# EAGLE design buratino (EAGLE 7.1.0)
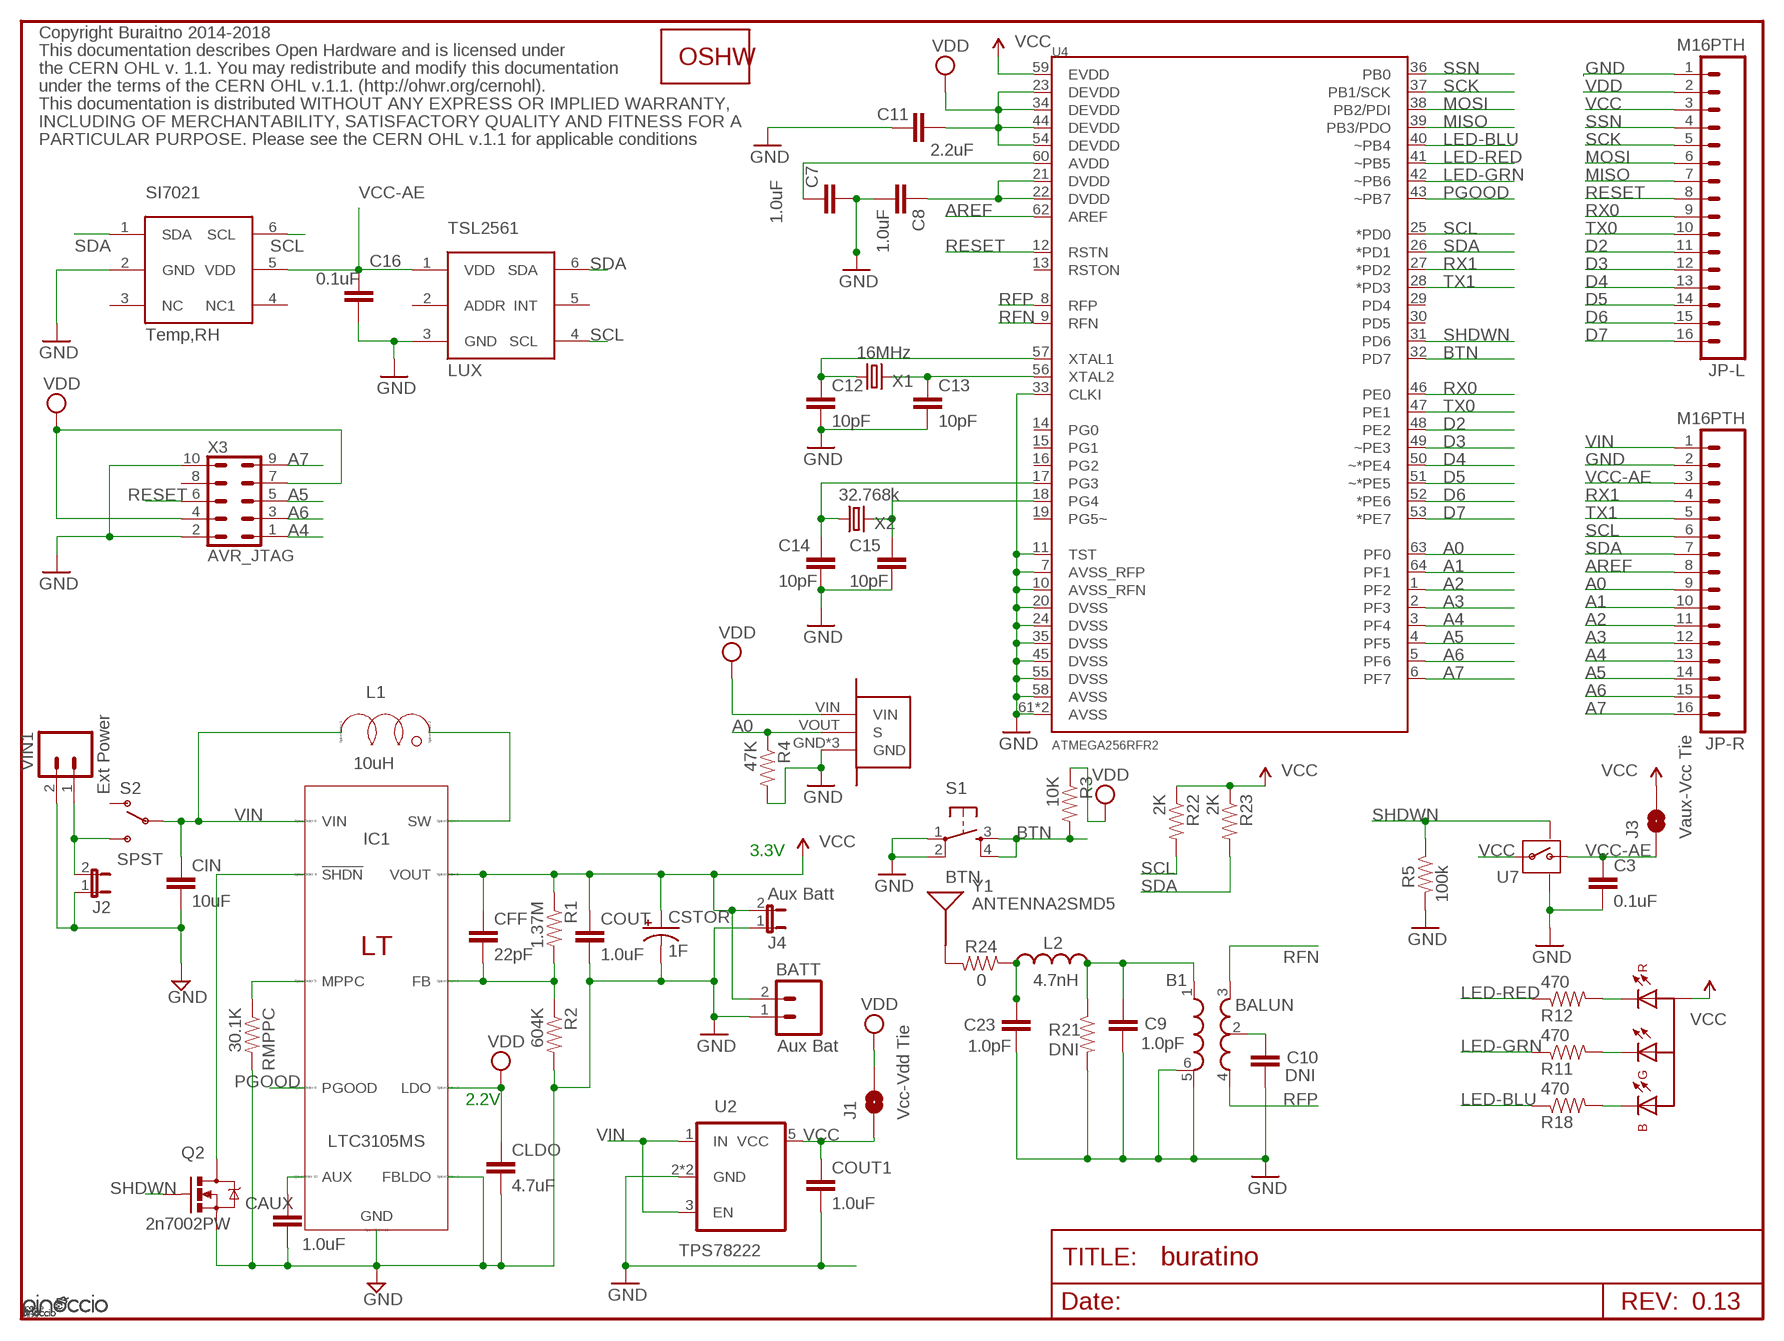
[diagram p0: schematic, sheet 1]

## Parts
B1  BALUN  BALUN0805  [BALUN]
BATT  Aux Bat  M02JST-SFH  [JST-SFH]
C3  0.1uF  CAP0603-CAP  [0603-CAP]
C7  1.0uF  CAP0603-CAP  [0603-CAP]
C8  1.0uF  CAP0603-CAP  [0603-CAP]
C9  1.0pF  CAP0402-CAP  [0402-CAP]
C10  DNI  CAP0402-CAP  [0402-CAP]
C11  2.2uF  CAP0603-CAP  [0603-CAP]
C12  10pF  CAP0402-CAP  [0402-CAP]
C13  10pF  CAP0402-CAP  [0402-CAP]
C14  10pF  CAP0402-CAP  [0402-CAP]
C15  10pF  CAP0402-CAP  [0402-CAP]
C16  0.1uF  CAP0603-CAP  [0603-CAP]
C23  1.0pF  CAP0402-CAP  [0402-CAP]
CAUX  1.0uF  CAP0603-CAP  [0603-CAP]
CFF  22pF  CAP0603-CAP  [0603-CAP]
CIN  10uF  CAP0805  [0805]
CLDO  4.7uF  CAP0603-CAP  [0603-CAP]
COUT  1.0uF  CAP0603-CAP  [0603-CAP]
COUT1  1.0uF  CAP0603-CAP  [0603-CAP]
CSTOR  1F  EEC-RG0V105H  [SCAP1]
IC1  LTC3105MS  [MSOP12]
J1  Vcc-Vdd Tie  SOLDERJUMPERNO  [SJ_2S-NO]
J2  Ext Battery  JUMPER-2PTH  [1X02]
J3  Vaux-Vcc Tie  SOLDERJUMPERNO  [SJ_2S-NO]
J4  Aux Batt  JUMPER-2PTH  [1X02]
JP-L  M16PTH  [1X16]
JP-R  M16PTH  [1X16]
L1  10uH  NR6045T100M  [NR2]
L2  4.7nH  INDUCTOR  [0402-CAP]
PIR  IRS-B210ST01R1  [PIRSMT]
Q2  2n7002PW  MOSFET-NCHANNEL2N7002PW  [SOT323]
R1  1.37M  RESISTOR0603-RES  [0603-RES]
R2  604K  RESISTOR0603-RES  [0603-RES]
R3  10K  RESISTOR0603-RES  [0603-RES]
R4  47K  RESISTOR0603-RES  [0603-RES]
R5  100k  RESISTOR0603-RES  [0603-RES]
R11  470  RESISTOR0603-RES  [0603-RES]
R12  470  RESISTOR0603-RES  [0603-RES]
R18  470  RESISTOR0603-RES  [0603-RES]
R21  DNI  RESISTOR0402-RES  [0402-RES]
R22  2K  RESISTOR0603-RES  [0603-RES]
R23  2K  RESISTOR0603-RES  [0603-RES]
R24  0  RESISTOR0402-RES  [0402-RES]
RMPPC  30.1K  RESISTOR0603-RES  [0603-RES]
S1  BTN  TAC_SWITCHPTH  [TACTILE-PTH]
S2  SPST  SWITCH-SPSTSMD2  [SWITCH-SPDT-SMD]
SI7021  Temp,RH  SI7021A10  [DFN6-3X3]
TSL2561  LUX  TSL2561DFN  [DFN6-2X2]
U2  TPS78222  LDO-TPS78233  [SOT23-5]
U4  ATMEGA256RFR2  ATMEGA128RFA1  [QFN-64]
U7  SWITCH  SWITCH-MOSFETTDFN4  [TDFN4]
U8  LED-RGB  LED-RGBPLCC4  [PLCC4]
U$2  LOGO-OSHWSILKSCREEN  [LOGO-OSHW-SS]
VIN1  Ext Power  M02JST-SFH  [JST-SFH]
X1  16MHz  CRYSTALABM10  [CRYSTAL-SMD-2.5X2-ABM10]
X2  32.768k  CRYSTAL-NOGND  [CRYSTAL-SMD-2X1.2-ABS06]
X3  AVR_JTAG  PHB_1MM27_2X05_SNS  [PHB_1MM27_2X05_SNS]
Y1  ANTENNA2SMD5  [ANTENNA-CHIP5]

## Nets
A0: JP-R.9 PIR.VOUT(S) R4.1 U4.63(PF0)
A1: JP-R.10 U4.64(PF1)
A2: JP-R.11 U4.1(PF2)
A3: JP-R.12 U4.2(PF3)
A4: JP-R.13 U4.3(PF4) X3.1
A5: JP-R.14 U4.4(PF5) X3.5
A6: JP-R.15 U4.5(PF6) X3.3
A7: JP-R.16 U4.6(PF7) X3.9
AREF: JP-R.8 U4.62(AREF)
BTN: R3.2 S1.3 S1.4 U4.32(PD7)
D2: JP-L.11 U4.48(PE2)
D3: JP-L.12 U4.49(~PE3)
D4: JP-L.13 U4.50(~*PE4)
D5: JP-L.14 U4.51(~*PE5)
D6: JP-L.15 U4.52(*PE6)
D7: JP-L.16 U4.53(*PE7)
GND [GND]: B1.5(GND) B1.6(GND) BATT.1 C3.2 C7.2 C8.2 C9.2 C10.2 C11.2 C12.2 C13.2 C14.2 C15.2 C16.2 C23.2 CAUX.2 CIN.2 CLDO.2 COUT1.2 COUT.2 CSTOR.2(-) IC1.3(FBLDO) IC1.6(GND) IC1.7(GND) J2.1 J4.1 JP-L.1 JP-R.2 PIR.GND PIR.GND*1(GND) PIR.GND*2(GND) Q2.2(S) R2.2 R4.2 R5.2 R21.2 RMPPC.2 S1.1 S1.2 SI7021.2(GND) TSL2561.3(GND) U2.2(GND) U2.4(GND) U4.7(AVSS_RFP) U4.10(AVSS_RFN) U4.11(TST) U4.20(DVSS) U4.24(DVSS) U4.33(CLKI) U4.35(DVSS) U4.45(DVSS) U4.55(DVSS) U4.58(AVSS) U4.61(AVSS) U4.PADDLE(AVSS) U7.P$2(GND) U7.P$5(GND) VIN1.2 X3.2 X3.10
LED-BLU: R18.1 U4.40(~PB4)
LED-GRN: R11.1 U4.42(~PB6)
LED-RED: R12.1 U4.41(~PB5)
MISO: JP-L.7 U4.39(PB3/PDO)
MOSI: JP-L.6 U4.38(PB2/PDI)
N$1: R12.2 U8.P$1(R-C)
N$2: C23.1 L2.2 R24.1
N$4 [RF Antenna]: B1.1(IN) C9.1 L2.1 R21.1
N$5: R11.2 U8.P$4(G-C)
N$6: R18.2 U8.P$3(B-C)
N$10: C7.1 U4.60(AVDD)
N$12: IC1.9(SW) L1.P$2(B)
N$13: B1.2(RFGND) C10.1
N$14: CAUX.1 IC1.12(AUX)
N$15: C12.1 U4.57(XTAL1) X1.P$1
N$16: C13.1 U4.56(XTAL2) X1.P$3
N$17: C14.1 U4.17(PG3) X2.P$1
N$18: C15.1 U4.18(PG4) X2.P$2
N$19: CFF.2 IC1.1(FB) R1.2 R2.1
N$20: C8.1 U4.21(DVDD) U4.22(DVDD)
N$21: IC1.4(!SHDN) Q2.3(D)
N$23: IC1.5(MPPC) RMPPC.1
N$24: J2.2 S2.3(S) VIN1.1
N$28: R24.2 Y1.FEED(SIGNAL)
PGOOD: IC1.10(PGOOD) U4.43(~PB7)
RESET: JP-L.8 U4.12(RSTN) X3.6
RFN: B1.3(OUT1) U4.9(RFN)
RFP: B1.4(OUT2) U4.8(RFP)
RX0: JP-L.9 U4.46(PE0)
RX1: JP-R.4 U4.27(*PD2)
SCK: JP-L.5 U4.37(PB1/SCK)
SCL: JP-R.6 R22.2 SI7021.6(SCL) TSL2561.4(SCL) U4.25(*PD0)
SDA: JP-R.7 R23.2 SI7021.1(SDA) TSL2561.6(SDA) U4.26(*PD1)
SHDWN: Q2.1(G) R5.1 U4.31(PD6) U7.P$4(ON)
SSN: JP-L.4 U4.36(PB0)
TX0: JP-L.10 U4.47(PE1)
TX1: JP-R.5 U4.28(*PD3)
VCC [VCC]: BATT.2 CFF.1 COUT1.1 COUT.1 CSTOR.1(+) IC1.11(VOUT) J1.1 J3.2 J4.2 JP-L.3 R1.1 R22.1 R23.1 U2.5(VCC) U4.59(EVDD) U7.P$3(IN) U8.P$2(A)
VCC-AE: C3.1 C16.1 J3.1 JP-R.3 SI7021.5(VDD) TSL2561.1(VDD) U7.P$1(OUT)
VDD: C11.1 CLDO.1 IC1.2(LDO) J1.2 JP-L.2 PIR.VIN R3.1 U4.23(DEVDD) U4.34(DEVDD) U4.44(DEVDD) U4.54(DEVDD) X3.4 X3.7
VIN: CIN.1 IC1.8(VIN) JP-R.1 L1.P$1(A) S2.2(P) U2.1(IN) U2.3(EN)
Unconnected: S2.1(O) SI7021.3(NC) SI7021.4(NC1) TSL2561.2(ADDR) TSL2561.5(INT) U4.13(RSTON) U4.14(PG0) U4.15(PG1) U4.16(PG2) U4.19(PG5~) U4.29(PD4) U4.30(PD5) X3.8

## Notes on the sheet
- Copyright Buraitno 2014-2018
- This documentation describes Open Hardware and is licensed under
- the CERN OHL v. 1.1. You may redistribute and modify this documentation
- under the terms of the CERN OHL v.1.1. (http://ohwr.org/cernohl).
- This documentation is distributed WITHOUT ANY EXPRESS OR IMPLIED WARRANTY,
- INCLUDING OF MERCHANTABILITY, SATISFACTORY QUALITY AND FITNESS FOR A
- PARTICULAR PURPOSE. Please see the CERN OHL v.1.1 for applicable conditions
- 3.3V
- 2.2V
- 0.13
- /Volumes/Data/Users/eric/Desktop/pinoccio.bmp
- /Volumes/Data/Users/eric/Desktop/pinoccio-1in.bmp | /Volumes/Data/Users/eric/Desktop/pinoccio-full-3-4in.bmp | /Volumes/Data/Users/eric/Desktop/pinoccio-full-3-4in.bmp

## Power pins joined to a net without a drawn wire
GND: X1.P$2(GND) X1.P$4(GND)

## Library data of the parts
B1 = Pinoccio:BALUN
BATT VIN1 = bean:M02: Header 2 Standard 2-pin 0.1" header. Use with straight break away headers (SKU : PRT-00116), right angle break away headers (PRT-00553), swiss pins (PRT-00743), machine pins (PRT-00117), and female headers (PRT-00115). Molex polarized connector foot print use with SKU : PRT-08233 with associated crimp pins and housings.
C3 C7-C16 C23 CAUX CFF CIN CLDO COUT COUT1 = Pinoccio:CAP: Capacitor Standard 0603 ceramic capacitor, and 0.1" leaded capacitor.
CSTOR = 620-Misc:EEC-RG
IC1 = @Power:LTC3105: LT-Spice library generated with : ltspice.ulp from: D:/Program Files (x86)/LTC/LTspiceIV/lib/sym/PowerProducts/LTC3108*.asy at 07.10.2012 17:14:56
J1 J3 = Pinoccio:SOLDERJUMPER: Solder Jumper Standard SMD solder jumper. Used to automate production. Two varients : Normally Open and Normally Closed are the same, but have different paste layers. NC will have a large amount of paste and should jumper during reflow.
J2 J4 = Pinoccio:JUMPER-2: Jumper Basic 0.1" spaced jumper. Use with breakaway headers.
JP-L JP-R = 620-Misc:M16
L1 = @Misc:NR6045
L2 = Pinoccio:INDUCTOR
PIR = 620-Sensors:IRS-B210ST01
Q2 = SparkFun-DiscreteSemi:MOSFET-NCHANNEL: Common NMOSFET Parts MFG P/N Store ID Prod ID FDD8780 TRANS-09984 SI7820DN TRANS-11055 FDS6630A IC-08089 2N7002PW TRANS-11151 FQP30N06L COM-10213 TRANS-10060 BSS123LT1G TRANS-08345 BSS138 TRANS-00830 BS170 2N7000; PROD_ID: TRANS-11151
R1-R5 R11 R12 R18 R21-R24 RMPPC = Pinoccio:RESISTOR: Resistor Basic schematic elements and footprints for 0603, 1206, and PTH resistors.
S1 = SparkFun-Electromechanical:TAC_SWITCH: Momentary Switch Button commonly used for reset or general input. Spark Fun Electronics SKU : COM-00097 SMT- SWCH-08247
S2 = Pinoccio:SWITCH-SPST: SPST Switch Simple slide switch. Spark Fun Electronics SKU : COM-00102
SI7021 = @Sensors:SI7021
TSL2561 = @Sensors:TSL2561
U2 = Pinoccio:LDO-TPS78233: Voltage Regulator LDO 500nA Ground Current, 150mA, Ultra-Low Quiescent Current Low-Dropout Linear Regulator.
U4 = Pinoccio:ATMEGA128RFA1
U7 = Pinoccio:SWITCH-MOSFET
U8 = Pinoccio:LED-RGB: LED-Bicolor Red/Green
U$2 = Pinoccio:LOGO-OSHW
X1 = Pinoccio:CRYSTAL: Crystals Various standard crystals. Proven footprints. Spark Fun Electronics SKU : COM-00534
X2 = Pinoccio:CRYSTAL-NOGND
X3 = 620-Misc:PHB_1MM27_2X05_*: Pin Header Box-Type, 1.27mm/0.5"/50mil Pitch, 2x05 Circuits Note: see library description for an important note about THT-version
Y1 = SparkFun:ANTENNA2: Antenna Single endded antenna. Common with smaller chip antennas. CHIP4 package is the GPS Chip Antenna SKU: GPS-08418. CHIP5 package is 2.4GHz chip antenna SKU: WRL-00144.

## Net classes
0 Default: width 0.203 mm
1 VCC: width 0.305 mm
2 LEDPower: width 0.203 mm
3 ButtonSignal: width 0.203 mm
4 RF Antenna: width 0.305 mm
5 GND: width 0.203 mm

## Board
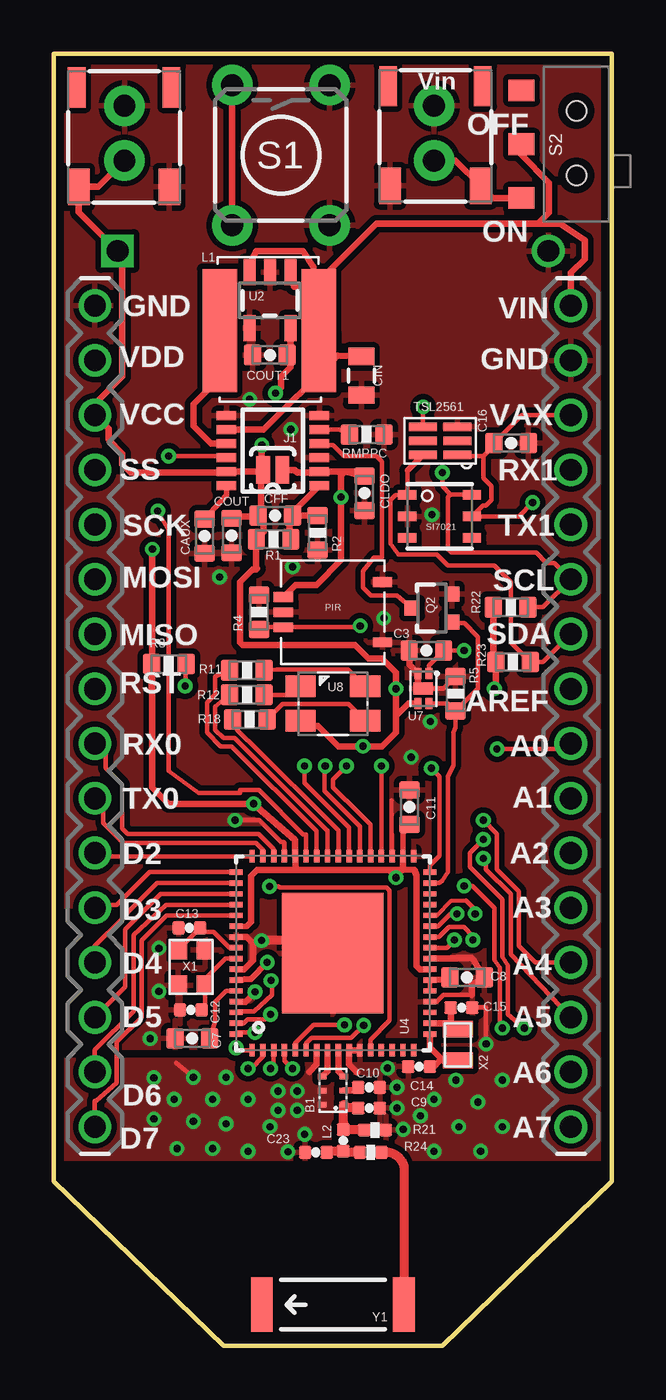
[diagram p1: board, top side]
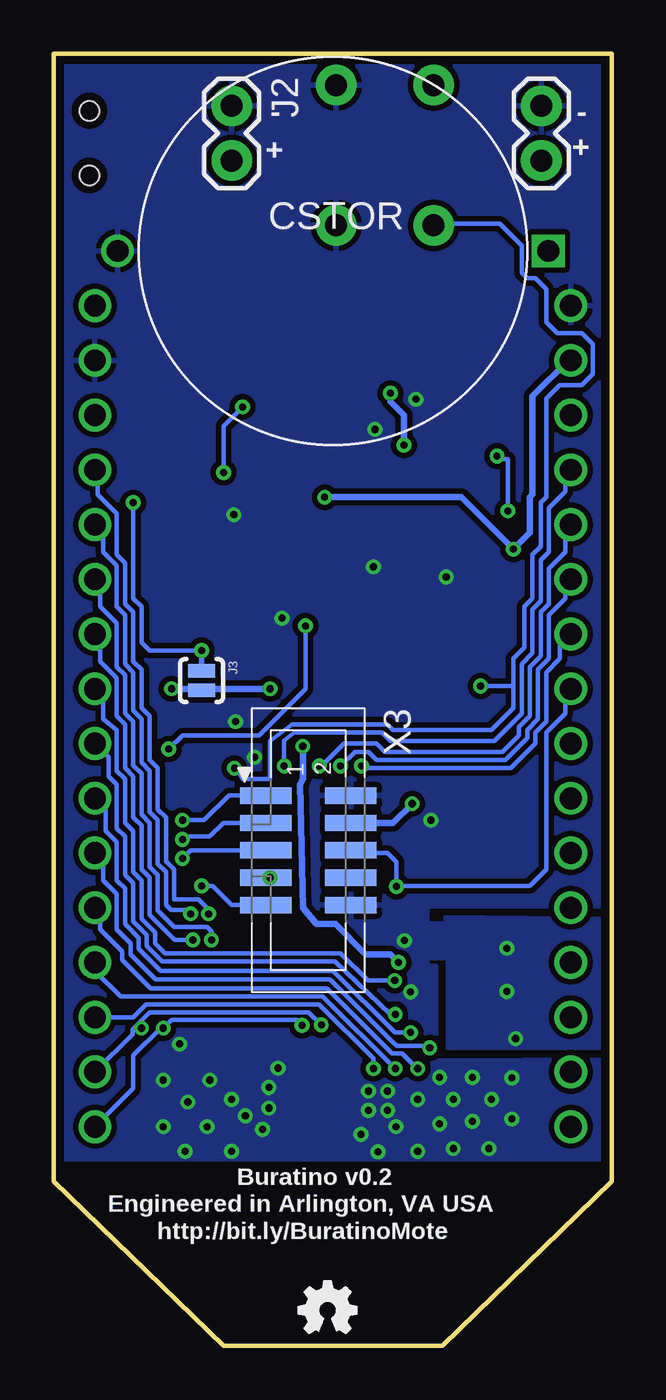
[diagram p2: board, bottom side, seen from below]

Size 25.91 x 59.94 mm. Coordinates in mm from the lower left corner, seen from the top.
Outline: 18.03,0 7.87,0 0,7.62 0,59.94 25.91,59.94 25.91,7.62 18.03,0
Copper layers (1*16): Top 0.0356mm / dielectric 1.5011mm / Bottom 0.0356mm
Design rules "OshPark": minimum track width 6mil, minimum drill 13mil, track to track 6mil, track to pad 6mil, pad to pad 6mil, via to via 6mil, smd to smd 6mil, copper to edge 15mil, drill to drill 6mil, minimum pad ring 7mil, minimum via ring 7mil, stop-mask expansion 3mil, vias tented up to drill 0mil, thermal gap 10mil
tKeepout: area 12.7,11.3 to 13.6,11.7; area 11.8,11.9 to 12.4,12.4; area 13.4,12.1 to 13.9,12.4; area 11.7,11.7 to 12.2,11.9; area 11.7,11.3 to 12.6,11.7

### Footprints (pad centres in the part's own frame; a part is rotated, then mirrored left to right if it is on the bottom)
BALUN = smd 0.27 x 0.4: 1 -0.7,-0.5; 2 -0.05,-0.5; 3 0.6,-0.5; 4 0.6,0.5; 5 -0.05,0.5; 6 -0.7,0.5
JST-SFH = smd 1.7 x 1: 1 5.36,4.7; 2 5.36,0.5 | smd 1.876 x 0.813: P$0 0.74,4.8; P$1 0.74,0.4
0603-CAP = smd 0.8 x 0.95: 1 -0.8,0; 2 0.8,0
0402-CAP = smd 0.6 x 0.6: 1 -0.5,0; 2 0.5,0
0805 = smd 0.8 x 1.2: 1 -0.9,0; 2 0.9,0
SCAP1 = drill 1.016 square: 1 10,0 | drill 1.016: 2 -10,0
MSOP12 = smd 0.9 x 0.42: 1 -2.163,1.625; 2 -2.163,0.975; 3 -2.163,0.325; 4 -2.163,-0.325; 5 -2.163,-0.975; 6 -2.163,-1.625; 7 2.15,-1.625; 8 2.15,-0.975; 9 2.15,-0.325; 10 2.15,0.325; 11 2.15,0.975; 12 2.15,1.625
SJ_2S-NO = smd 0.635 x 1.27: 1 -0.45,0; 2 0.45,0
1X02 = drill 1.016 pad 1.88: 1 0,0; 2 2.54,0
1X16 = drill 1.016 pad 1.27: 1 0,0 | drill 1.016: 2 2.54,0; 3 5.08,0; 4 7.62,0; 5 10.16,0; 6 12.7,0; 7 15.24,0; 8 17.78,0; 9 20.32,0; 10 22.86,0; 11 25.4,0; 12 27.94,0; 13 30.48,0; 14 33.02,0; 15 35.56,0; 16 38.1,0
NR2 = smd 1.6 x 5.7: P$1 2.3,0; P$2 -2.3,0
PIRSMT = smd 0.9 x 0.45: GND -2.3,0; GND*1 2.3,1.4; GND*2 2.3,-1.4; VIN -2.3,0.7; VOUT -2.3,-0.7
SOT323 = smd 0.7 x 0.7: 1 -0.65,-0.925; 2 0.65,-0.925; 3 0,0.925
0603-RES = smd 0.8 x 0.95: 1 -0.8,0; 2 0.8,0
0402-RES = smd 0.6 x 0.6: 1 -0.5,0; 2 0.5,0
TACTILE-PTH = drill 1.016 pad 1.88: 1 -3.251,2.261; 2 3.251,2.261; 3 -3.251,-2.261; 4 3.251,-2.261
SWITCH-SPDT-SMD = smd 1 x 1.2: 1 -2.5,-2.55; 2 0,-2.55; 3 2.5,-2.55 | hole 0.9: -1.55,0; 1.45,0
DFN6-3X3 = smd 0.85 x 0.45: 1 -1.5,1; 2 -1.5,0; 3 -1.5,-1; 4 1.5,-1; 5 1.5,0; 6 1.5,1
DFN6-2X2 = smd 1.3 x 0.4: 1 -0.8,0.65; 2 -0.8,0; 3 -0.8,-0.65; 4 0.8,-0.65; 5 0.8,0; 6 0.8,0.65
SOT23-5 = smd 0.55 x 1.2: 1 -0.95,-1.3; 2 0,-1.3; 3 0.95,-1.3; 4 0.95,1.3; 5 -0.95,1.3
QFN-64 = smd 0.6 x 0.25: 1 -4.5,3.75; 2 -4.5,3.25; 3 -4.5,2.75; 4 -4.5,2.25; 5 -4.5,1.75; 6 -4.5,1.25; 7 -4.5,0.75; 8 -4.5,0.25; 9 -4.5,-0.25; 10 -4.5,-0.75; 11 -4.5,-1.25; 12 -4.5,-1.75; 13 -4.5,-2.25; 14 -4.5,-2.75; 15 -4.5,-3.25; 16 -4.5,-3.75; 33 4.5,-3.75; 34 4.5,-3.25; 35 4.5,-2.75; 36 4.5,-2.25; 37 4.5,-1.75; 38 4.5,-1.25; 39 4.5,-0.75; 40 4.5,-0.25; 41 4.5,0.25; 42 4.5,0.75; 43 4.5,1.25; 44 4.5,1.75; 45 4.5,2.25; 46 4.5,2.75; 47 4.5,3.25; 48 4.5,3.75 | smd 0.25 x 0.6: 17 -3.75,-4.5; 18 -3.25,-4.5; 19 -2.75,-4.5; 20 -2.25,-4.5; 21 -1.75,-4.5; 22 -1.25,-4.5; 23 -0.75,-4.5; 24 -0.25,-4.5; 25 0.25,-4.5; 26 0.75,-4.5; 27 1.25,-4.5; 28 1.75,-4.5; 29 2.25,-4.5; 30 2.75,-4.5; 31 3.25,-4.5; 32 3.75,-4.5; 49 3.75,4.5; 50 3.25,4.5; 51 2.75,4.5; 52 2.25,4.5; 53 1.75,4.5; 54 1.25,4.5; 55 0.75,4.5; 56 0.25,4.5; 57 -0.25,4.5; 58 -0.75,4.5; 59 -1.25,4.5; 60 -1.75,4.5; 61 -2.25,4.5; 62 -2.75,4.5; 63 -3.25,4.5; 64 -3.75,4.5 | smd 5.588 x 4.699: PADDLE 0,0
TDFN4 = smd 0.325 x 0.5: P$1 0.35,0.1; P$2 0.85,0.1; P$3 0.85,1.5; P$4 0.35,1.5 | smd 0.9 x 0.55: P$5 0.6,0.8
PLCC4 = smd 1.4 x 1: P$1 -1.5,0.75; P$2 -1.5,-0.85; P$3 1.5,-0.85; P$4 1.5,0.75
CRYSTAL-SMD-2.5X2-ABM10 = smd 0.9 x 0.8: P$1 -0.85,-0.65; P$2 0.8,-0.65; P$3 0.8,0.6; P$4 -0.85,0.6
CRYSTAL-SMD-2X1.2-ABS06 = smd 0.75 x 1.4: P$1 -0.725,0; P$2 0.725,0
PHB_1MM27_2X05_SNS = smd 0.76 x 2.4: 1 -2.54,-1.977; 2 -2.54,1.977; 3 -1.27,-1.977; 4 -1.27,1.977; 5 0,-1.977; 6 0,1.977; 7 1.27,-1.977; 8 1.27,1.977; 9 2.54,-1.977; 10 2.54,1.977
ANTENNA-CHIP5 = smd 1.016 x 2.54: FEED -3.302,0; NC 3.302,0

### Placement (x,y rotation side)
B1  12.95,11.89 90 top
BATT  0.66,59.13 270 top
C3  17.3,32.26 180 top
C7  6.43,14.26 180 top
C8  19.18,17.09 0 top
C9  14.63,11.02 0 top
C10  14.63,11.99 0 top
C11  16.51,24.99 90 top
C12  6.36,15.58 180 top
C13  6.29,19.39 180 top
C14  16.95,12.95 180 top
C15  18.92,15.69 0 top
C16  21.23,41.88 0 top
C23  12.17,8.97 180 top
CAUX  7,37.57 270 top
CFF  10.27,38.52 0 top
CIN  14.27,45.01 270 top
CLDO  14.41,39.56 270 top
COUT  8.25,37.59 270 top
COUT1  10.03,45.97 180 top
CSTOR  12.95,50.8 0 bottom
IC1  10.16,41.53 180 top
J1  10.16,40.64 0 top
J2  17.65,57.53 270 bottom
J3  19.05,30.86 270 bottom
J4  3.28,57.53 270 bottom
JP-L  1.91,48.26 270 top
JP-R  24,48.26 270 top
L1  9.99,47.1 0 top
L2  13.44,9.53 270 top
PIR  12.95,34.04 0 top
Q2  17.55,34.23 90 top
R1  10.2,37.41 0 top
R2  12.24,37.72 270 top
R3  5.33,31.62 0 top
R4  9.53,34.04 90 top
R5  18.64,30.25 90 top
R11  8.97,31.34 0 top
R12  8.97,30.2 0 top
R18  9.09,29.06 0 top
R21  14.91,10.01 0 top
R22  21.21,34.26 0 top
R23  21.31,31.72 0 top
R24  14.71,8.97 0 top
RMPPC  14.52,42.28 0 top
S1  10.54,55.24 270 top
S2  24.26,55.75 270 top
SI7021  17.91,38.48 0 top
TSL2561  17.94,41.99 180 top
U2  10.03,48.51 180 top
U4  12.95,18.21 90 top
U7  17.75,31.29 180 top
U8  12.95,29.84 0 top
U$2  14.61,0.51 0 bottom
VIN1  15.11,59.18 270 top
X1  6.38,17.57 90 top
X2  18.76,13.96 90 top
X3  14.1,22.99 270 bottom
Y1  12.95,1.91 180 top

### Tracks (layer width: path | path; a pad name or v marks a point on that pad's centre or on a via)
A0  (via drill 0.33)
  Top 0.203: v10.06,15.37 9.83,15.14 8.99,15.14 8.81,14.96 U4.63 | U4.63 8.43,14.96 | U4.63 | R4.1 9.62,33.34 PIR.VOUT 14.16,33.34 v14.22,33.4 | v20.57,27.69 23.75,27.69 JP-R.9
  Bottom 0.203: v10.06,15.37 10.29,15.37 12.85,17.83 20.88,17.83 21.59,18.54 21.59,19.05 22.23,19.68 22.23,21.46 22.61,21.84 22.61,23.62 22.99,24 22.99,26.04 23.37,26.42 23.37,27.3 JP-R.9 | v14.22,33.4 14.22,30.48 16.38,28.32 19.94,28.32 v20.57,27.69
A1  (via drill 0.33)
  Top 0.203: U4.64 8.52,14.53 v9.35,14.53
  Bottom 0.203: v9.35,14.53 10.08,14.53 12.95,17.4 20.96,17.4 21.97,18.41 21.97,18.92 22.61,19.56 22.61,21.21 22.99,21.59 22.99,23.37 23.5,23.88 23.5,24.89 JP-R.10
A2  (via drill 0.33)
  Top 0.203: v8.46,13.82 8.56,13.71 U4.1
  Bottom 0.203: v8.46,13.82 8.56,13.92 9.98,13.92 10.21,14.12 13.08,16.99 21.18,16.99 22.35,18.16 22.35,18.67 22.99,19.3 22.99,20.95 23.62,21.59 23.62,22.48 JP-R.11
A3  (via drill 0.33)
  Top 0.203: U4.2 9.7,13.41 9.14,12.85 v9.02,12.85
  Bottom 0.203: v9.02,12.85 9.02,12.83 9.75,13.56 10.21,13.56 13.23,16.59 21.41,16.59 22.73,17.91 22.73,18.29 23.75,19.3 23.75,20.07 JP-R.12
A4  (via drill 0.33)
  Top 0.203: U4.3 10.2,13 v10.06,12.85 | JP-R.13 22.35,17.78 21.59,18.54 21.59,21.08 20.57,22.1 20.57,23.75 v19.94,24.38
  Bottom 0.203: v10.06,12.85 13.44,16.2 22.81,16.2 24,17.4 JP-R.13 | X3.1 17.78,25.53 18.92,24.38 v19.94,24.38
A5  (via drill 0.33)
  Top 0.203: U4.4 10.7,13.22 v11.07,12.85 | JP-R.14 21.21,18.16 21.21,20.95 20.07,22.1 20.07,22.48 v19.94,22.61
  Bottom 0.203: v11.07,12.85 11.07,13.34 13.6,15.84 21.63,15.84 22.23,15.24 JP-R.14 | X3.5 19.56,22.99 v19.94,22.61
A6  (via drill 0.33)
  Top 0.203: U4.5 11.2,14.02 12.06,14.88 v13.49,14.88 | v19.94,23.5 19.3,22.86 19.3,22.23 20.83,20.7 20.83,18.03 21.08,17.65 21.08,15.37 v21.84,14.73
  Bottom 0.203: v13.49,14.88 14.07,15.47 21.46,15.47 21.84,15.09 | 21.84,15.09 22.25,14.68 22.25,14.45 JP-R.15 | v21.84,14.73 21.84,15.09 | X3.3 18.03,24.26 18.67,23.62 19.81,23.62 v19.94,23.5
A7  (via drill 0.33)
  Top 0.203: U4.6 11.7,14.02 11.96,14.28 13.78,14.28 v14.39,14.86 | v19.05,21.34 19.43,21.34 20.45,20.32 20.45,17.91 20.7,17.53 20.7,14.86 v20.83,14.73
  Bottom 0.203: v14.39,14.86 14.4,14.88 14.63,15.11 20.45,15.11 v20.83,14.73 20.96,14.73 22.23,13.46 22.23,11.94 JP-R.16 | X3.9 17.65,20.45 18.54,21.34 v19.05,21.34
AREF  (via drill 0.33)
  Top 0.203: v10.08,16.94 10.13,16.92 10.13,16.28 9.29,15.51 8.5,15.51 U4.62
  Bottom 0.203: v10.08,16.94 11.33,16.94 12.6,18.21 20.75,18.21 21.21,18.67 21.21,19.18 21.84,19.81 21.84,21.59 22.23,21.97 22.23,23.88 22.61,24.26 22.61,26.29 22.99,26.67 22.99,28.57 23.62,29.08 23.62,29.97 JP-R.8
BTN  (via drill 0.33)
  Top 0.203: U4.32 17.45,22.28 17.91,22.73 17.91,26.42 v17.53,26.8 | R3.2 v6.1,30.61
  Top 0.305: S1.3 S1.4
  Bottom 0.203: v17.53,26.8 17.53,26.92 17.14,26.29 15.88,26.29 15.88,28.07 14.86,28.83 10.41,28.83 10.16,28.57 5.59,28.57 4.57,29.59 4.57,30.61 | S1.4 8.2,52.07 5.21,52.07 4.19,51.05 4.19,49.78 3.94,49.53 3.56,49.53 3.05,49.02 3.05,47.5 2.54,46.99 1.4,46.99 0.89,46.48 0.89,45.09 1.4,44.58 2.41,44.58 3.05,43.94 3.05,39.37 3.3,39.12 3.3,37.08 3.68,36.7 3.68,34.67 4.06,34.29 4.06,32.38 4.57,31.88 4.57,30.61 | 4.57,30.61 v6.1,30.61
D2
  Top 0.203: U4.48 2.05,22.71 JP-L.11
D3
  Top 0.203: U4.49 8.38,21.98 4.45,21.98 2.92,20.45 2.03,20.45 JP-L.12
D4
  Top 0.203: U4.50 4.8,21.46 3.17,19.84 3.17,19.81 1.91,18.54 JP-L.13
D5
  Top 0.203: U4.51 4.96,20.96 3.3,19.3 3.3,16.64 JP-L.14
D6
  Top 0.203: U4.52 5.22,20.46 3.71,19.05 3.71,15.52 1.91,13.72 JP-L.15
D7
  Top 0.203: U4.53 5.23,19.96 4.06,18.8 4.06,15.24 2.92,14.1 2.92,12.19 1.97,11.37 1.91,11.37 JP-L.16
GND  (via drill 0.33)
  Top 0.203: U4.35 15.67,22.73 15.67,25.3 | 10.7,23.33 U4.45 10.7,23.33 10.67,23.37 10.54,23.37 9.53,24.38 v8.41,24.38 | U4.20 17.77,15.96 18.09,16.28 19.41,16.28 | 19.41,15.7 20.07,15.7 v20.07,13.99 | 5.67,13.12 v6.48,12.45 | U7.P$5 18.09,30.49 R5.2
  Top 0.305: U4.7 12.2,13.04 11.86,12.7 | U4.10 13.7,13.04 14.07,12.68 | U4.61 8.9,15.96 v9.35,16.41 | U4.10 | U4.58 8.83,17.46 9.25,17.88 9.25,18.67 8.95,18.96 U4.55 | U4.11 U4.10 | U4.24 18.69,17.96 18.71,17.98 19.38,17.98 19.42,17.98 C8.2 19.41,16.77 19.41,16.28 | C15.2 19.41,15.7 | C3.2 16.5,31.6 U7.P$2 16.91,30.74 U7.P$5
  Top 0.406: U4.PADDLE 11.63,18.21 11.05,18.8 v9.64,18.8
  Bottom 0.305: v9.35,16.41 9.42,16.48
  other vias: 10.86,8.99 15.93,11.02 4.47,14.25 4.88,16.43 11.64,9.8 16.22,10.03 15.93,11.99 4.88,18.44 15.49,12.88 15.32,33.76 11.07,36.14 9.09,43.92 11,42.52 7.7,35.66 4.64,12.42 4.64,10.52 5.71,9.14 5.59,11.43 6.48,10.41 7.37,11.43 8,10.29 7.37,9.14 9.02,9.02 8,12.45 9.02,11.43 20.83,12.32 10.03,10.16 11.3,10.92 10.41,10.92 10.41,11.81 11.3,11.81 20.83,10.16 19.81,9.02 18.8,10.16 17.65,9.02 17.02,10.67 17.65,11.43 19.69,11.3 18.67,12.32 16.59,27.3 17.55,38.56 17.48,28.96
  pour Top (isolate 0.254): 0.3,59.46 25.55,59.44 25.55,50.82 25.58,50.82 25.59,50.29 25.6,41 25.63,39.75 25.6,39.09 25.65,13.83 17.68,13.79 17.42,13.79 8.46,13.77 8.61,20.38 0.23,20.38 0.2,39.42 0.2,50.62 0.3,50.62
  pour Bottom (isolate 0.254): 0.33,59.56 25.81,59.59 25.68,50.75 25.6,50.75 25.6,40.41 25.63,39.22 25.63,33.48 25.65,13.8 17.53,13.82 17.45,13.82 8.56,13.79 8.56,20.38 0.25,20.35 0.2,39.47 0.2,39.67 0.25,40.44 0.25,50.8
  pour Top (isolate 0.254, rank 2): 0.13,13.26 8.15,13.26 8.15,13.94 17.6,13.94 25.78,13.92 25.73,8.64 0.05,8.66
  pour Top: -0.03,13.82 0.05,19.81 7.7,19.81 7.7,19.53 8.66,19.53 8.61,17.93 7.7,17.96 7.67,13.82
  pour Bottom (isolate 0.254): 0.13,14.5 0.13,17.75 0.18,19.81 7.72,19.89 7.7,19.58 8.28,19.58 8.76,19.61 8.74,17.98 7.62,17.98 7.62,13.82 0.05,13.82
  pour Bottom (isolate 0.254): 0.15,13.28 8.18,13.23 8.18,17.63 17.48,17.65 25.78,17.65 25.73,13.82 25.73,13.51 25.76,8.64 0.1,8.64
  pour Top (rank 2, no thermals): 12.57,11.94 11.23,11.91 11.25,9.8 12.55,9.8 12.55,10.19
LED-BLU
  Top 0.203: U4.40 13.2,23.91 9.02,28.09 8.99,28.09 8.51,28.57 8.51,28.71 R18.1 8.38,29.1 8.38,28.7
LED-GRN
  Top 0.203: U4.42 12.19,22.72 12.19,23.88 8.25,27.81 7.75,27.81 7.11,28.45 7.11,29.84 7.49,30.23 7.49,31.05 R11.1
LED-RED
  Top 0.203: U4.41 12.7,23.9 12.68,23.9 8.38,28.19 7.87,28.19 7.49,28.57 7.49,29.65 R12.1
MISO  (via drill 0.33)
  Top 0.203: U4.39 13.7,24.04 11.63,26.11 v11.63,26.9
  Bottom 0.203: v11.63,26.9 11.53,26.8 4.7,26.8 3.56,27.94 3.56,28.45 3.05,28.96 3.05,31.24 2.41,31.88 2.41,32.51 JP-L.7
MOSI  (via drill 0.33)
  Top 0.203: U4.38 14.2,24.1 12.57,25.73 12.57,26.87 v12.6,26.9
  Bottom 0.203: v12.6,26.9 11.94,27.56 11.3,27.56 10.92,27.18 4.95,27.18 3.94,28.19 3.94,28.57 3.43,29.08 3.43,31.37 2.92,31.88 2.92,33.91 2.16,34.67 2.16,35.31 JP-L.6
N$1
  Top 0.203: 11.45,30.2 U8.P$1 11.44,30.2 R12.2
N$2
  Top 0.406: R24.1 13.49,8.97 L2.2 12.72,9.03 C23.1
N$4
  Top 0.406: C9.1 13.45,11.02 | 13.45,11.02 13.45,10.33 L2.1 14.33,10.03 R21.1 | 13.45,11.02 B1.1
N$5
  Top 0.203: R11.2 10.33,31.37 13.66,31.37 14.44,30.59 U8.P$4
N$6
  Top 0.203: U8.P$3 13.68,29.77 10.62,29.77 10.03,29.18 R18.2
N$10
  Top 0.203: U4.60 8,16.46 7.49,15.95 7.49,15.03 C7.1
  Top 0.254: U4.60
N$12
  Top 0.305: IC1.9 7.29,41.85 6.48,42.67 6.48,43.69 8,45.21 8,47.16 L1.P$2
N$13
  Top 0.305: C10.1 14.12,11.84 B1.2
N$14
  Top 0.254: IC1.12 8.01,39.46 CAUX.1
N$15
  Top 0.203: C12.1 7.03,15.85 X1.P$1 7.03,17.01 7.98,17.96 U4.57
N$16
  Top 0.203: 6.81,19.56 C13.1 | X1.P$3 5.95,18.55 C13.1 | U4.56 8.18,18.46 8.15,18.47 7.42,19.2 6.97,19.2 C13.1
N$17
  Top 0.305: U4.17 17.45,13.84 18,13.3 | 18,13.3 18.11,13.18 18.71,13.18 X2.P$1 | C14.1 17.52,12.82 18,13.3
N$18
  Top 0.305: C15.1 18.42,14.79 18.37,14.92 | 18.37,14.92 X2.P$2 | U4.18 18.32,14.96 18.37,14.92
N$19
  Top 0.203: 10.94,37.22 R1.2
  Top 0.254: 10.94,38.52 IC1.1
  Top 0.305: CFF.2 10.94,38.52 10.94,37.48 R1.2 | 10.86,38.6 CFF.2 | CFF.2 R2.1 | R2.1
N$20
  Top 0.203: U4.21 U4.22 | 18.05,16.99 18.07,16.99 C8.1
  Top 0.305: U4.22 18.05,16.99
N$21
  Top 0.203: IC1.4 12.39,41.78 12.95,41.78 13.46,41.27 14.99,41.27 15.24,41.02 15.24,36.58 14.86,36.58 14.35,35.94 14.35,35.18 14.73,34.8 15.93,34.8 Q2.3
N$23
  Top 0.203: IC1.5 13.28,42.5 RMPPC.1
N$24
  Top 0.305: S2.3 20.38,53.25 VIN1.1 18.64,54.99 J2.2
N$28
  Top 0.406: R24.2 arc-90 16.26,8.3 Y1.FEED
PGOOD  (via drill 0.33)
  Top 0.203: U4.43 11.7,23.73 11.58,23.73 9.53,25.78 8.64,25.78 8.64,25.65 6.73,25.65 5.33,26.67 5.33,37.85 4.95,38.48 v4.83,38.73 | v5.33,41.27 7.94,41.27 IC1.10
  Bottom 0.203: v4.83,38.73 4.83,41.15 5.21,41.15 v5.33,41.27
RESET  (via drill 0.33)
  Top 0.203: U4.12 14.7,13.99 14.71,13.99 14.71,14.2 15.57,15.09 15.57,21.13 15.44,21.26 10.49,21.26 10.41,21.31 v10.01,21.31
  Bottom 0.203: X3.6 11.99,22.86 10.41,22.86 10.01,22.45 v10.01,21.31 9.98,21.34 3.81,21.34 3.05,22.1 3.05,28.45 2.16,29.34 2.16,30.23 JP-L.8
RFN
  Top 0.305: U4.9 13.2,12.74 B1.3
RFP
  Top 0.305: U4.8 12.7,12.74 B1.4
RX0
  Top 0.203: U4.46 10.2,23.05 9.5,23.75 3.43,23.75 3.17,24 3.17,26.04 2.41,26.8 2.41,27.43 JP-L.9
RX1  (via drill 0.33)
  Top 0.203: U4.27 17.84,19.46 18.42,20.04 v18.72,20.04
  Bottom 0.203: v18.72,20.04 18.72,20.14 | 18.72,20.14 18.75,20.14 | 18.72,20.14 18.72,20.24 19.18,20.7 20.32,20.7 20.32,22.1 20.7,22.48 20.7,24.51 21.08,24.89 21.08,26.8 21.46,27.18 21.46,29.21 21.84,29.59 21.84,31.37 22.23,31.75 22.23,34.04 22.61,34.42 22.61,36.32 22.99,36.7 22.99,38.61 23.88,39.5 23.88,40.51 JP-R.4
SCK  (via drill 0.33)
  Top 0.203: U4.37 14.7,24.18 13.59,25.3 13.56,25.3 12.95,25.91 12.95,26.26 v13.59,26.9
  Bottom 0.203: v13.59,26.9 13.49,26.9 12.45,27.94 10.92,27.94 10.54,27.56 5.08,27.56 4.32,28.32 4.32,28.7 3.81,29.21 3.81,31.5 3.3,32 3.3,34.04 2.92,34.42 2.92,36.07 2.16,36.83 2.16,37.85 JP-L.5
SCL  (via drill 0.33)
  Top 0.203: U4.25 18.26,18.46 v18.59,18.82 | 18.42,39.5 18.29,39.37 18.29,36.96 18.45,36.79 22.39,36.79 22.86,36.32 23.24,36.32 JP-R.6 22.71,34.27 R22.2 | 18.42,39.5 19.39,39.5 SI7021.6 | 18.42,39.5 18.03,39.88 v18.03,40.51 | v17.14,43.56 TSL2561.4
  Bottom 0.203: v18.59,18.82 18.59,19.23 18.8,19.43 20.32,19.43 21.08,20.19 21.08,21.84 21.46,22.23 21.46,24.26 21.84,24.64 21.84,26.54 22.23,26.92 22.23,28.96 22.61,29.34 22.61,31.11 22.99,31.5 22.99,33.53 23.75,34.29 23.75,35.31 JP-R.6 | v18.03,40.51 18.03,42.67 v17.14,43.56
SDA  (via drill 0.33)
  Top 0.203: U4.26 17.87,18.96 18.34,19.43 19.03,19.43 19.46,19 v19.46,18.82 | JP-R.7 22.71,31.73 R23.2 21.21,32.63 21.21,35.43 20.45,36.2 18.29,36.2 17.78,36.7 16,36.7 15.62,37.21 15.62,39.24 15.86,39.48 SI7021.1 16.41,40.61
  Top 0.254: 16.41,40.61 TSL2561.6
  Bottom 0.203: v19.46,18.82 20.3,18.82 21.46,19.99 21.46,21.72 21.84,22.1 21.84,24.13 22.23,24.51 22.23,26.42 22.61,26.8 22.61,28.83 22.99,29.21 22.99,30.99 23.75,31.75 23.75,32.77 JP-R.7
SHDWN
  Top 0.203: U4.31 17.91,21.46 18.03,21.59 18.29,21.97 18.29,26.42 18.54,26.92 18.54,28.45 18.64,28.68 R5.1 | R5.1 18.66,29.45 | Q2.1 18.53,33.53 19.05,33.53 19.69,32.89 19.69,30.48 19.67,30.48 R5.1 | U7.P$4 18.3,29.79 R5.1
SSN  (via drill 0.33)
  Top 0.203: U4.36 15.2,24.24 15.21,24.87 v15.21,26.9
  Bottom 0.203: v15.21,26.9 15.21,28.09 14.73,28.45 10.67,28.45 10.29,28.07 5.46,28.07 4.19,29.34 4.19,31.62 3.68,32.13 3.68,34.16 3.3,34.54 3.3,36.45 2.92,36.83 2.92,38.86 2.16,39.62 2.16,40.39 JP-L.4
TX0
  Top 0.203: U4.47 9.7,23.01 9.4,23.32 3.23,23.32 2.29,24.26 2.29,25.02 JP-L.10 | 9.7,22.66 U4.47 | U4.47
TX1  (via drill 0.33)
  Top 0.178: 17.78,19.96 18.47,20.65 19.13,20.65
  Top 0.203: U4.28 17.78,19.96 | 19.13,20.65 19.56,20.22 v19.56,20.04
  Bottom 0.203: v19.56,20.04 19.53,20.22 20.47,20.22 20.7,20.45 20.7,21.97 21.08,22.35 21.08,24.38 21.46,24.77 21.46,26.67 21.84,27.05 21.84,29.08 22.23,29.46 22.23,31.24 22.61,31.62 22.61,33.91 22.99,34.29 22.99,36.2 23.62,36.83 23.62,37.72 JP-R.5
VCC  (via drill 0.33)
  Top 0.305: U8.P$2 11.48,28.75 12.27,28.75 13.21,27.81 v14.35,27.81 15.24,27.81 15.88,28.45 15.88,29.21 | v9.91,17.78 9.14,17.02 U4.59 | 9.73,38.47 CFF.1 9.62,38.67 9.62,40.55 | 9.4,36.02 9.44,36.07 | 9.4,36.02 R1.1 9.73,37.74 9.73,38.47 | 9.73,38.47 8.34,38.47 COUT.1 | U2.5 10.98,45.62 | 10.98,45.62 COUT1.1 | J4.2 2.06,53.77 BATT.2 1.16,52.59 CSTOR.1 3.17,50.58 3.17,44.96 1.91,43.69 JP-L.3 2.54,42.55 2.54,42.04 3.17,41.4 3.17,40.89 3.56,40.51 7.97,40.51 IC1.11 9.62,40.55 | 9.4,36.02 9.22,36.02 8.64,35.43 8.64,32.64 8.76,32.51 13.97,32.51 14.61,31.88 15.24,31.88 15.88,31.24 v15.88,30.48 15.88,29.21 | 10.98,45.62 10.98,45.4 10.54,44.96 10.54,44.45 v10.29,44.2 | v9.65,41.78 9.65,40.7 J1.1 9.62,40.55 | R22.1 20.41,31.83 R23.1 20.51,30.54 v20.45,30.48 | 16.89,29.78 U7.P$3 16.46,29.79 15.88,29.21
  Bottom 0.305: v9.91,17.78 10.29,18.16 11.43,18.16 12.83,19.56 13.72,19.56 14.35,20.32 14.48,26.04 14.35,26.29 v14.35,27.81 | v10.29,44.2 10.29,43.81 9.65,43.18 v9.65,41.78 | v15.88,30.48 v20.45,30.48 19.12,30.48 J3.2
VCC-AE  (via drill 0.33)
  Top 0.203: JP-R.3 21.73,43.18 C16.1 20.43,41.76 19.94,41.27 | 19.94,41.27 18.8,41.27 TSL2561.1 | 19.94,41.27 19.94,40.26 20.32,39.88 20.32,39.24 20.07,38.99 19.92,38.99 SI7021.5 21.59,38.48 v22.23,39.12 | v19.05,32.26 C3.1 17.41,31.57 U7.P$1
  Bottom 0.203: v22.23,39.12 22.23,34.67 21.84,34.29 21.84,32.64 21.46,32.26 v19.05,32.26
  Bottom 0.254: v19.05,32.26 J3.1
VDD  (via drill 0.33)
  Top 0.254: 9.14,19.66 8.94,19.46 U4.54 | U4.34 16.2,23.76 C11.1
  Top 0.305: 17.08,17.46 U4.23 17.01,17.46 16.84,17.63 16.84,21.82 16.74,22.07 16.21,22.1 | U4.34 16.21,22.1 | 11.23,22.07 15.6,22.07 | 11.23,22.07 11.23,22.69 U4.44 11.2,23.47 v9.27,25.15 5.33,25.15 4.57,25.91 4.57,30.48 | 16.21,22.1 16.21,22.07 15.6,22.07 | 11.23,22.07 9.42,22.07 9.14,21.79 9.14,19.66 | 4.57,30.48 v4.57,36.96 | 15.6,22.07 v15.88,21.72 | J1.2 11.18,40.64 11.3,40.51 12.28,40.51 IC1.2 14.27,40.55 CLDO.1 13.52,40.57 13.33,40.39 v13.33,39.37 13.33,36.45 12.19,35.31 11.22,35.31 PIR.VIN | R3.1 4.53,30.52 4.57,30.48
  Bottom 0.305: v4.57,36.96 4.57,37.08 | v13.33,39.37 6.98,39.37 v4.57,36.96 | X3.4 10.16,24.26 v9.27,25.15 | v15.88,21.72 15.37,21.72 15.49,21.59 15.95,21.59 X3.7 | JP-L.2 2.03,45.72 3.68,44.07 3.68,39.5 3.81,39.37 3.81,37.72 v4.57,36.96
VIN
  Top 0.305: IC1.8 9.74,42.5 12.95,45.72 | 12.95,45.72 12.95,46.95 L1.P$1 | 12.92,46.99 L1.P$1 | CIN.1 13.17,45.94 12.95,45.72 | S2.2 21.71,55.26 22.99,53.98 22.99,52.58 22.48,52.07 | 22.48,52.07 14.99,52.07 12.06,49.15 | 12.06,49.15 12.06,47.33 L1.P$1 | 12.06,49.15 12.06,50.04 11.56,50.8 9.4,50.8 9.14,50.29 9.14,49.37 U2.3 | 12.06,49.15 11.14,49.15 U2.1 | 22.48,52.07 23.5,52.07 24.64,51.31 24.64,50.42 24,49.78 JP-R.1

### Text on the board
tPlace: Vin | OFF | ON | VIN | GND | GND | VDD | VAX | VCC | RX1 | SS | TX1 | SCK | SCL | MOSI | SDA | MISO | RST | AREF | A0 | RX0 | A1 | TX0 | A2 | D2 | A3 | D3 | A4 | D4 | A5 | D5 | A6 | D6 | A7 | D7
bPlace: - | - | + | + | Buratino v0.2 | Engineered in Arlington, VA USA | http://bit.ly/BuratinoMote
tDocu: Buratino v1.0 | Design by: Val Orekhov, based on Pinoccio(tm) designs | http://bit.ly/BuratinoMote | Licensed under CERN OHL v.1.1